# EAGLE schematic Central_MABOS (EAGLE 9.7.0)
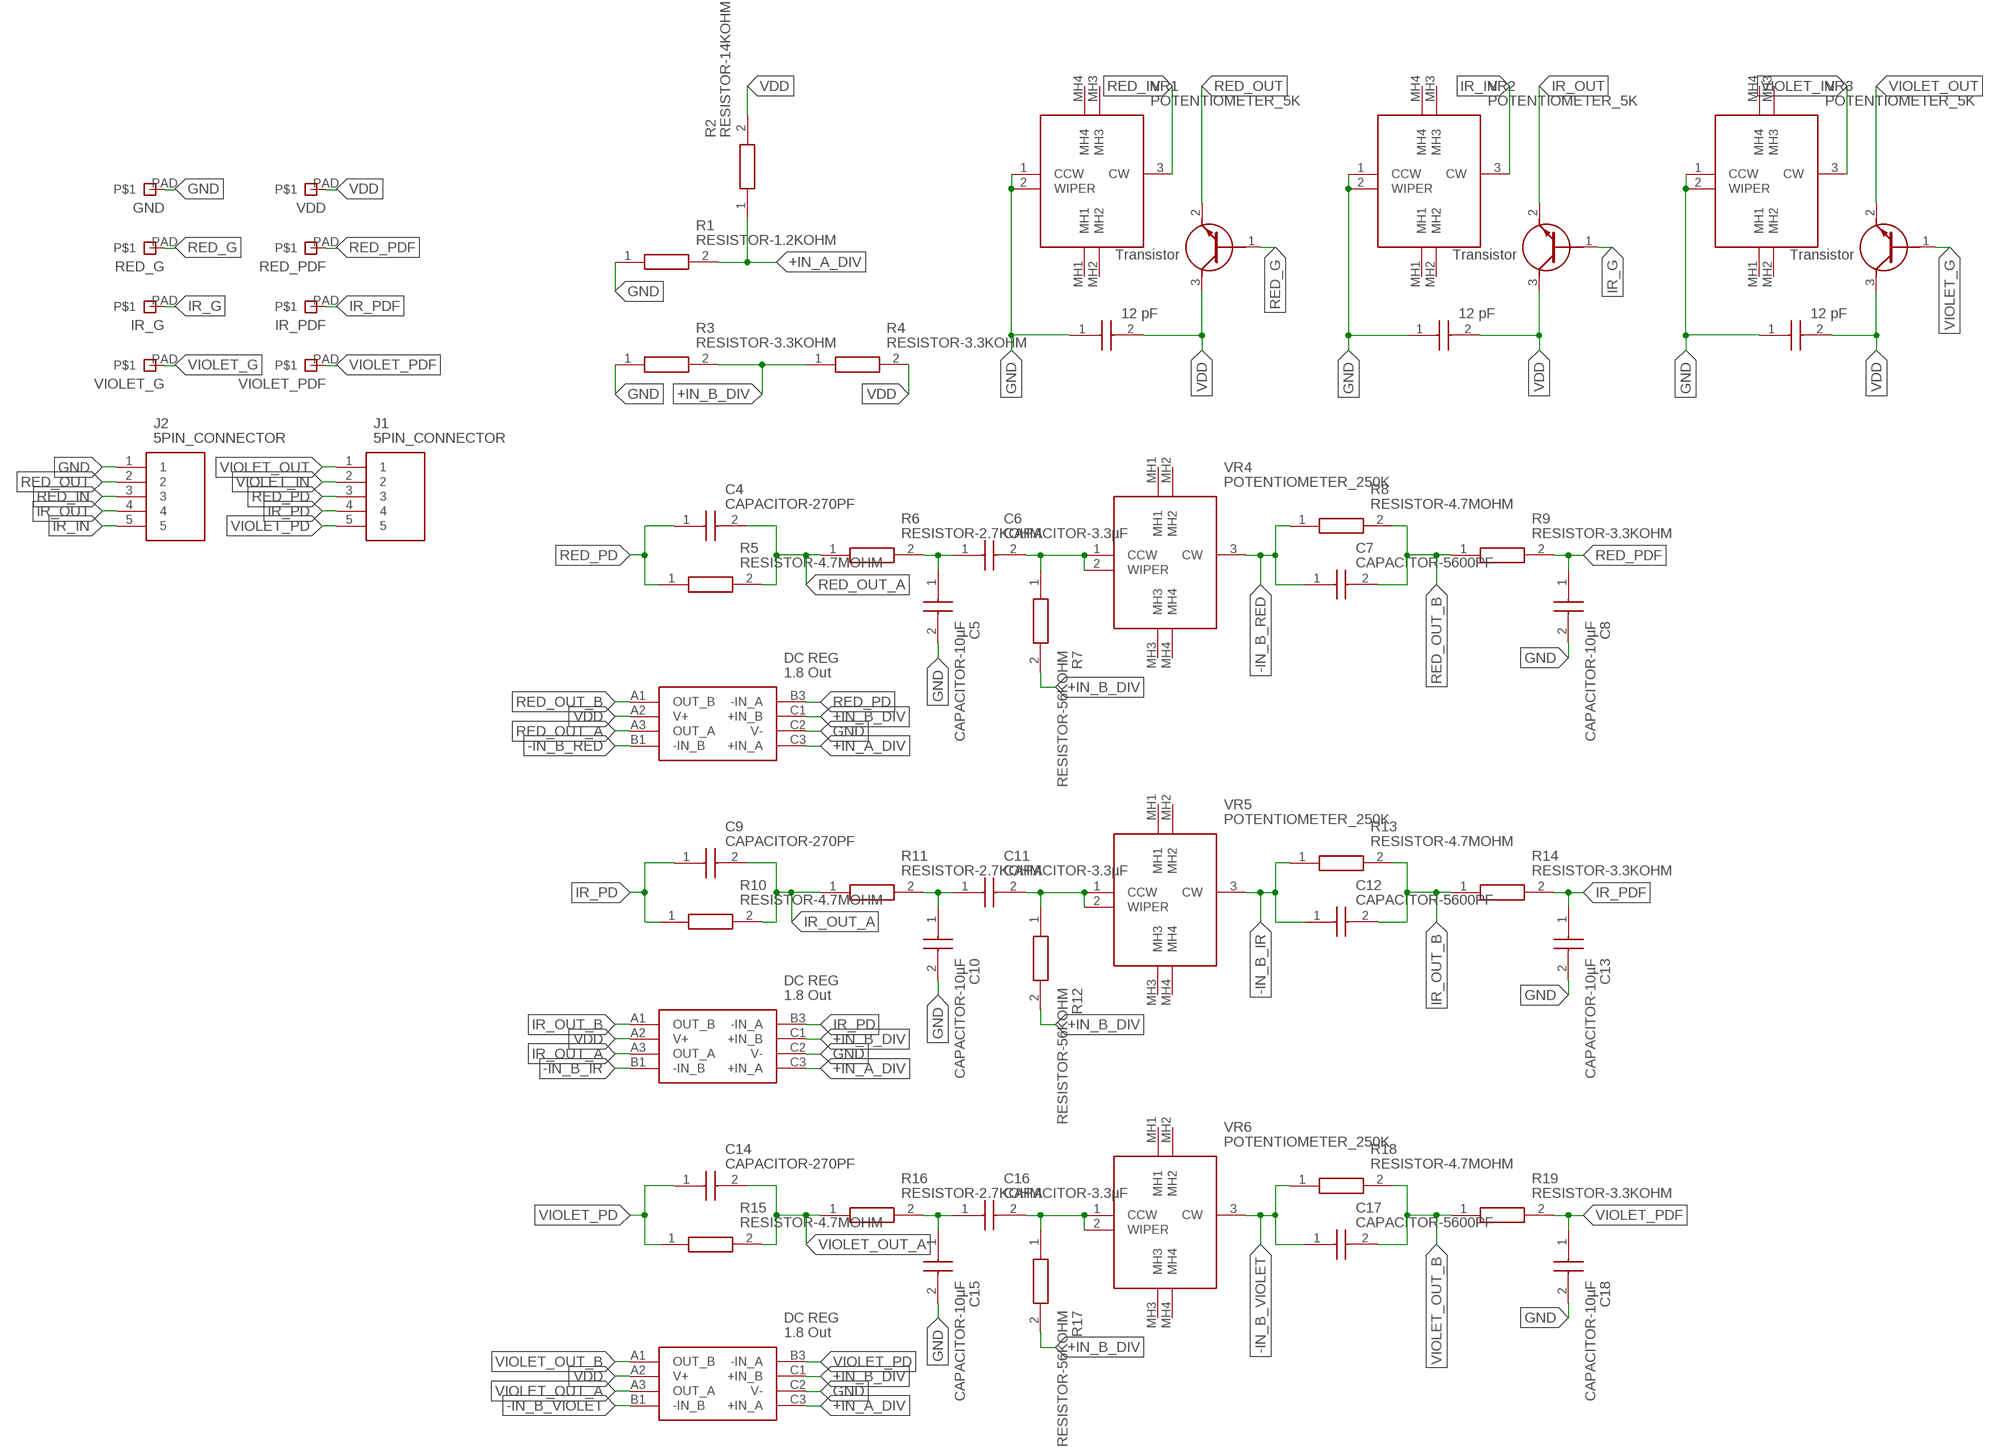
[diagram p0: schematic, sheet 1]

## Parts
C1  CAPACITOR-12PF  [CAPC1005X55N]
C2  CAPACITOR-12PF  [CAPC1005X55N]
C3  CAPACITOR-12PF  [CAPC1005X55N]
C4  CAPACITOR-270PF  [CAPC1005X55N]
C5  CAPACITOR-10µF  [C0402]
C6  CAPACITOR-3.3µF  [C0402]
C7  CAPACITOR-5600PF  [CAPC1005X55N]
C8  CAPACITOR-10µF  [C0402]
C9  CAPACITOR-270PF  [CAPC1005X55N]
C10  CAPACITOR-10µF  [C0402]
C11  CAPACITOR-3.3µF  [C0402]
C12  CAPACITOR-5600PF  [CAPC1005X55N]
C13  CAPACITOR-10µF  [C0402]
C14  CAPACITOR-270PF  [CAPC1005X55N]
C15  CAPACITOR-10µF  [C0402]
C16  CAPACITOR-3.3µF  [C0402]
C17  CAPACITOR-5600PF  [CAPC1005X55N]
C18  CAPACITOR-10µF  [C0402]
GND  PAD  [PAD]
IC1  ADA4505-2  [BGA8C50P3X3_142X142X65]
IC2  ADA4505-2  [BGA8C50P3X3_142X142X65]
IC3  ADA4505-2  [BGA8C50P3X3_142X142X65]
IR_G  PAD  [PAD]
IR_PDF  PAD  [PAD]
J1  5PIN_CONNECTOR  [SHDR5W114P0X419_1X5_2228X658X1]
J2  5PIN_CONNECTOR  [SHDR5W114P0X419_1X5_2228X658X1]
Q1  TRANSISTOR  [SOT883B]
Q2  TRANSISTOR  [SOT883B]
Q3  TRANSISTOR  [SOT883B]
R1  RESISTOR-1.2KOHM  [ERJPA2_(0402)]
R2  RESISTOR-14KOHM  [ERJ2RKD1004X]
R3  RESISTOR-3.3KOHM  [ERJPA2_(0402)]
R4  RESISTOR-3.3KOHM  [ERJPA2_(0402)]
R5  RESISTOR-4.7MOHM  [ERJ2RKD1004X]
R6  RESISTOR-2.7KOHM  [ERJPA2_(0402)]
R7  RESISTOR-56KOHM  [ERJ2RKD1004X]
R8  RESISTOR-4.7MOHM  [ERJ2RKD1004X]
R9  RESISTOR-3.3KOHM  [ERJPA2_(0402)]
R10  RESISTOR-4.7MOHM  [ERJ2RKD1004X]
R11  RESISTOR-2.7KOHM  [ERJPA2_(0402)]
R12  RESISTOR-56KOHM  [ERJ2RKD1004X]
R13  RESISTOR-4.7MOHM  [ERJ2RKD1004X]
R14  RESISTOR-3.3KOHM  [ERJPA2_(0402)]
R15  RESISTOR-4.7MOHM  [ERJ2RKD1004X]
R16  RESISTOR-2.7KOHM  [ERJPA2_(0402)]
R17  RESISTOR-56KOHM  [ERJ2RKD1004X]
R18  RESISTOR-4.7MOHM  [ERJ2RKD1004X]
R19  RESISTOR-3.3KOHM  [ERJPA2_(0402)]
RED_G  PAD  [PAD]
RED_PDF  PAD  [PAD]
VDD  PAD  [PAD]
VIOLET_G  PAD  [PAD]
VIOLET_PDF  PAD  [PAD]
VR1  POTENTIOMETER_5K  [POTENTIOMETER]
VR2  POTENTIOMETER_5K  [POTENTIOMETER]
VR3  POTENTIOMETER_5K  [POTENTIOMETER]
VR4  POTENTIOMETER_250K  [PTA60432015DPB254]
VR5  POTENTIOMETER_250K  [PTA60432015DPB254]
VR6  POTENTIOMETER_250K  [PTA60432015DPB254]

## Nets
+IN_A_DIV: IC1.C3(+IN_A) IC2.C3(+IN_A) IC3.C3(+IN_A) R1.2 R2.1
+IN_B_DIV: IC1.C1(+IN_B) IC2.C1(+IN_B) IC3.C1(+IN_B) R3.2 R4.1 R7.2 R12.2 R17.2
-IN_B_IR: C12.1 IC2.B1(-IN_B) R13.1 VR5.3(CW)
-IN_B_RED: C7.1 IC1.B1(-IN_B) R8.1 VR4.3(CW)
-IN_B_VIOLET: C17.1 IC3.B1(-IN_B) R18.1 VR6.3(CW)
GND: C1.1 C2.1 C3.1 C5.2 C8.2 C10.2 C13.2 C15.2 C18.2 GND.PAD IC1.C2(V-) IC2.C2(V-) IC3.C2(V-) J2.1 R1.1 R3.1 VR1.1(CCW) VR1.2(WIPER) VR2.1(CCW) VR2.2(WIPER) VR3.1(CCW) VR3.2(WIPER)
IR_G: IR_G.PAD Q2.1(B)
IR_IN: J2.5 VR2.3(CW)
IR_OUT: J2.4 Q2.2(E)
IR_OUT_A: C9.2 IC2.A3(OUT_A) R10.2 R11.1
IR_OUT_B: C12.2 IC2.A1(OUT_B) R13.2 R14.1
IR_PD: C9.1 IC2.B3(-IN_A) J1.4 R10.1
IR_PDF: C13.1 IR_PDF.PAD R14.2
N$3: C5.1 C6.1 R6.2
N$4: C6.2 R7.1 VR4.1(CCW) VR4.2(WIPER)
N$13: C10.1 C11.1 R11.2
N$14: C11.2 R12.1 VR5.1(CCW) VR5.2(WIPER)
N$23: C15.1 C16.1 R16.2
N$24: C16.2 R17.1 VR6.1(CCW) VR6.2(WIPER)
RED_G: Q1.1(B) RED_G.PAD
RED_IN: J2.3 VR1.3(CW)
RED_OUT: J2.2 Q1.2(E)
RED_OUT_A: C4.2 IC1.A3(OUT_A) R5.2 R6.1
RED_OUT_B: C7.2 IC1.A1(OUT_B) R8.2 R9.1
RED_PD: C4.1 IC1.B3(-IN_A) J1.3 R5.1
RED_PDF: C8.1 R9.2 RED_PDF.PAD
VDD: C1.2 C2.2 C3.2 IC1.A2(V+) IC2.A2(V+) IC3.A2(V+) Q1.3(C) Q2.3(C) Q3.3(C) R2.2 R4.2 VDD.PAD
VIOLET_G: Q3.1(B) VIOLET_G.PAD
VIOLET_IN: J1.2 VR3.3(CW)
VIOLET_OUT: J1.1 Q3.2(E)
VIOLET_OUT_A: C14.2 IC3.A3(OUT_A) R15.2 R16.1
VIOLET_OUT_B: C17.2 IC3.A1(OUT_B) R18.2 R19.1
VIOLET_PD: C14.1 IC3.B3(-IN_A) J1.5 R15.1
VIOLET_PDF: C18.1 R19.2 VIOLET_PDF.PAD
Unconnected: VR1.MH1 VR1.MH2 VR1.MH3 VR1.MH4 VR2.MH1 VR2.MH2 VR2.MH3 VR2.MH4 VR3.MH1 VR3.MH2 VR3.MH3 VR3.MH4 VR4.MH1 VR4.MH2 VR4.MH3 VR4.MH4 VR5.MH1 VR5.MH2 VR5.MH3 VR5.MH4 VR6.MH1 VR6.MH2 VR6.MH3 VR6.MH4

## Library data of the parts
C1-C3 = MABOS_components:CAPACITOR-12PF: 12 pF; DESCRIPTION: Multilayer Ceramic Capacitors MLCC - SMD/SMT 12pF 2% 25V C0G; HEIGHT: 0.55mm; MANUFACTURER_NAME: Kemet; MANUFACTURER_PART_NUMBER: C0402C120G3GACTU; MOUSER_PART_NUMBER: 80-C0402C120G3G; MOUSER_PRICE-STOCK: https://www.mouser.com/Search/Refine.aspx?Keyword=80-C0402C120G3G
C4 C9 C14 = MABOS_components:CAPACITOR-270PF: SMD Comm C0G, Ceramic, 270 pF, 2%, 50 VDC, 125 VDC, 125C, -55C, C0G, SMD, MLCC, Ultra-Stable, Low Loss, Class I, 0.1 % , 100 GOhms, 1.06 mg, 0402, 1mm, 0.5mm, 0.5mm, 0.3mm, 0.3mm, 10000, 78 Weeks, 120 Source: Datasheet <https://componentsearchengine.com/Datasheets/1/C0402C271G5GACTU.pdf>; DESCRIPTION: SMD Comm C0G, Ceramic, 270 pF, 2%, 50 VDC, 125 VDC, 125C, -55C, C0G, SMD, MLCC, Ultra-Stable, Low Loss, Class I, 0.1 % , 100 GOhms, 1.06 mg, 0402, 1mm, 0.5mm, 0.5mm, 0.3mm, 0.3mm, 10000, 78 Weeks, 120; HEIGHT: 0.55mm; MANUFACTURER_NAME: KEMET; MANUFACTURER_PART_NUMBER: C0402C271G5GACTU; MOUSER_PART_NUMBER: 80-C0402C271G5G; MOUSER_PRICE-STOCK: https://www.mouser.com/Search/Refine.aspx?Keyword=80-C0402C271G5G
C5 C8 C10 C13 C15 C18 = MABOS_components:CAPACITOR-10µF: SMD Comm X5R, Ceramic, 10 uF, 20%, 6.3 VDC, 15.75 VDC, 85C, -55C, X5R, SMD, MLCC, Temperature Stable, Class II, 10 % , 10 MOhms, 1.41 mg, 0402, 1mm, 0.5mm, 0.5mm, 0.3mm, 0.3mm, 10000, 78 Weeks, 70 Source: Datasheet <https://content.kemet.com/datasheets/KEM_C1006_X5R_SMD.pdf>; DESCRIPTION: SMD Comm X5R, Ceramic, 10 uF, 20%, 6.3 VDC, 15.75 VDC, 85C, -55C, X5R, SMD, MLCC, Temperature Stable, Class II, 10 % , 10 MOhms, 1.41 mg, 0402, 1mm, 0.5mm, 0.5mm, 0.3mm, 0.3mm, 10000, 78 Weeks, 70; HEIGHT: 0.55mm; MANUFACTURER_NAME: KEMET; MANUFACTURER_PART_NUMBER: C0402C106M9PACTU; MOUSER_PART_NUMBER: 80-C0402C106M9P; MOUSER_PRICE-STOCK: https://www.mouser.co.uk/ProductDetail/KEMET/C0402C106M9PACTU?qs=x4XeXhDQKnp%252Bz0lMlwMC3A%3D%3D
C6 C11 C16 = MABOS_components:CAPACITOR-3.3µF: SMD Comm X5R, Ceramic, 3.3 uF, 20%, 4 VDC, 10 VDC, 85C, -55C, X5R, SMD, MLCC, Temperature Stable, Class II, 10 % , 30.3 MOhms, 1.21 mg, 0402, 1mm, 0.5mm, 0.5mm, 0.3mm, 0.3mm, 10000, 78 Weeks, 70 Source: Datasheet <https://content.kemet.com/datasheets/KEM_C1006_X5R_SMD.pdf>; DESCRIPTION: SMD Comm X5R, Ceramic, 3.3 uF, 20%, 4 VDC, 10 VDC, 85C, -55C, X5R, SMD, MLCC, Temperature Stable, Class II, 10 % , 30.3 MOhms, 1.21 mg, 0402, 1mm, 0.5mm, 0.5mm, 0.3mm, 0.3mm, 10000, 78 Weeks, 70; HEIGHT: 0.55mm; MANUFACTURER_NAME: KEMET; MANUFACTURER_PART_NUMBER: C0402C335M7PACTU; MOUSER_PART_NUMBER: 80-C0402C335M7P; MOUSER_PRICE-STOCK: https://www.mouser.co.uk/ProductDetail/KEMET/C0402C335M7PACTU?qs=K%2Fj%2Fqf%252B0fqJuKSSbbJXSEQ%3D%3D
C7 C12 C17 = MABOS_components:CAPACITOR-5600PF: SMD Comm X7R, Ceramic, 5600 pF, 5%, 16 VDC, 40 VDC, 125C, -55C, X7R, SMD, MLCC, Temperature Stable, Class II, 3.5 % , 100 GOhms, 1.21 mg, 0402, 1mm, 0.5mm, 0.5mm, 0.3mm, 0.3mm, 10000, 78 Weeks, 80 Source: Datasheet <https://content.kemet.com/datasheets/KEM_C1002_X7R_SMD.pdf>; DESCRIPTION: SMD Comm X7R, Ceramic, 5600 pF, 5%, 16 VDC, 40 VDC, 125C, -55C, X7R, SMD, MLCC, Temperature Stable, Class II, 3.5 % , 100 GOhms, 1.21 mg, 0402, 1mm, 0.5mm, 0.5mm, 0.3mm, 0.3mm, 10000, 78 Weeks, 80; HEIGHT: 0.55mm; MANUFACTURER_NAME: KEMET; MANUFACTURER_PART_NUMBER: C0402C562J4RACTU; MOUSER_PART_NUMBER: 80-C0402C562J4R; MOUSER_PRICE-STOCK: https://www.mouser.co.uk/ProductDetail/KEMET/C0402C562J4RACTU?qs=YJD0VjdmSUns5e35Blws8w%3D%3D
GND IR_G IR_PDF RED_G RED_PDF VDD VIOLET_G VIOLET_PDF = Nordic_BLE:PAD
IC1-IC3 = MABOS_components:ADA4505-2: Op Amp (2); DESCRIPTION: ANALOG DEVICES - ADA4505-2ACBZ-R7 - OP-AMP, DUAL, 50KHZ, WLCSP-8; HEIGHT: 0.65mm; MANUFACTURER_NAME: Analog Devices; MANUFACTURER_PART_NUMBER: ADA4505-2ACBZ-R7; MOUSER_PART_NUMBER: 584-ADA4505-2ACBZ-R7; MOUSER_PRICE-STOCK: https://www.mouser.co.uk/ProductDetail/Analog-Devices/ADA4505-2ACBZ-R7?qs=BpaRKvA4VqEsLtXU3NSLDQ%3D%3D
J1 J2 = MABOS_components:5PIN_CONNECTOR: Samtec IPBT, 4.19mm Pitch, 5 Way, 1 Row PCB Terminal Block Header, Through Hole Source: Datasheet <http://suddendocs.samtec.com/catalog_english/ipbt.pdf>; DESCRIPTION: Samtec IPBT, 4.19mm Pitch, 5 Way, 1 Row PCB Terminal Block Header, Through Hole; HEIGHT: 10.29mm; MANUFACTURER_NAME: SAMTEC; MANUFACTURER_PART_NUMBER: IPBT-105-H1-T-S-K; MOUSER_PART_NUMBER: 200-IPBT105H1TSK; MOUSER_PRICE-STOCK: https://www.mouser.co.uk/ProductDetail/Samtec/IPBT-105-H1-T-S-K?qs=PB6%2FjmICvI0oo3MGzaPD2A%3D%3D
Q1-Q3 = MABOS_components:TRANSISTOR: Bipolar Transistors - BJT 45V NPN 100mA 250mW Source: Datasheet <https://componentsearchengine.com/Datasheets/1/BC847BMB,315.pdf>; DESCRIPTION: Bipolar Transistors - BJT 45V NPN 100mA 250mW; HEIGHT: mm; MANUFACTURER_NAME: Nexperia; MANUFACTURER_PART_NUMBER: BC847BMB,315; MOUSER_PART_NUMBER: 771-BC847BMB315; MOUSER_PRICE-STOCK: https://www.mouser.co.uk/ProductDetail/Nexperia/BC847BMB315?qs=5C9Q4QJFsuN7bUmIcU4LYw%3D%3D
R1 = MABOS_components:RESISTOR-1.2KOHM: Anti-Surge Thick Film Chip Resistor, 0402, 0.2W Source: Datasheet <https://componentsearchengine.com/Datasheets/1/ERJ-PA2D1201X.pdf>; DESCRIPTION: Anti-Surge Thick Film Chip Resistor, 0402, 0.2W; HEIGHT: 0.4mm; MANUFACTURER_NAME: Panasonic; MANUFACTURER_PART_NUMBER: ERJ-PA2D1201X; MOUSER_PART_NUMBER: 667-ERJ-PA2D1201X; MOUSER_PRICE-STOCK: https://www.mouser.com/Search/Refine.aspx?Keyword=667-ERJ-PA2D1201X
R2 = MABOS_components:RESISTOR-14KOHM: Panasonic ERJ2RK Series Thick Film Resistor 14k +/-1% 0.1W +/-100ppm/C Source: Datasheet <https://componentsearchengine.com/Datasheets/1/ERJ-2RKF1402X.pdf>; DESCRIPTION: Panasonic ERJ2RK Series Thick Film Resistor 14k +/-1% 0.1W +/-100ppm/C; HEIGHT: 0.4mm; MANUFACTURER_NAME: Panasonic; MANUFACTURER_PART_NUMBER: ERJ-2RKF1402X; MOUSER_PART_NUMBER: 667-ERJ-2RKF1402X; MOUSER_PRICE-STOCK: https://www.mouser.com/Search/ProductDetail.aspx?qs=MVjVSMjNRMrMgFTFLdW36A%3d%3d
R3 R4 R9 R14 R19 = MABOS_components:RESISTOR-3.3KOHM: Anti-Surge Thick Film Chip Resistor, 0402, 0.2W Source: Datasheet <https://componentsearchengine.com/Datasheets/1/ERJ-PA2F3301X.pdf>; DESCRIPTION: Anti-Surge Thick Film Chip Resistor, 0402, 0.2W; HEIGHT: 0.4mm; MANUFACTURER_NAME: Panasonic; MANUFACTURER_PART_NUMBER: ERJ-PA2F3301X; MOUSER_PART_NUMBER: 667-ERJ-PA2F3301X; MOUSER_PRICE-STOCK: https://www.mouser.com/Search/Refine.aspx?Keyword=667-ERJ-PA2F3301X
R5 R8 R10 R13 R15 R18 = MABOS_components:RESISTOR-4.7MOHM: Panasonic ERJ2GEJ Series Thick Film Surface Mount Fixed Resistor 0402 Case 4.7M +/-5% 0.1W -400 +150ppm/C Source: Datasheet <https://componentsearchengine.com/Datasheets/1/ERJ-2GEJ475X.pdf>; DESCRIPTION: Panasonic ERJ2GEJ Series Thick Film Surface Mount Fixed Resistor 0402 Case 4.7M +/-5% 0.1W -400 +150ppm/C; HEIGHT: 0.4mm; MANUFACTURER_NAME: Panasonic; MANUFACTURER_PART_NUMBER: ERJ-2GEJ475X; MOUSER_PART_NUMBER: 667-ERJ-2GEJ475X; MOUSER_PRICE-STOCK: https://www.mouser.com/Search/Refine.aspx?Keyword=667-ERJ-2GEJ475X
R6 R11 R16 = MABOS_components:RESISTOR-2.7KOHM: Anti-Surge Thick Film Chip Resistor, 0402, 0.2W Source: Datasheet <http://industrial.panasonic.com/cdbs/www-data/pdf/RDO0000/AOA0000C331.pdf>; DESCRIPTION: Anti-Surge Thick Film Chip Resistor, 0402, 0.2W; HEIGHT: 0.4mm; MANUFACTURER_NAME: Panasonic; MANUFACTURER_PART_NUMBER: ERJ-PA2F2701X
R7 R12 R17 = MABOS_components:RESISTOR-56KOHM: Precision Thick Film Chip Resistor, 0402, 0.063W Source: Datasheet <https://componentsearchengine.com/Datasheets/1/ERJ-2RKF5602X.pdf>; DESCRIPTION: Precision Thick Film Chip Resistor, 0402, 0.063W; HEIGHT: 0.4mm; MANUFACTURER_NAME: Panasonic; MANUFACTURER_PART_NUMBER: ERJ-2RKF5602X; MOUSER_PART_NUMBER: 667-ERJ-2RKF5602X; MOUSER_PRICE-STOCK: https://www.mouser.com/Search/Refine.aspx?Keyword=667-ERJ-2RKF5602X
VR1-VR3 = MABOS_components:POTENTIOMETER_5K: SLIDE POT 5K OHM TOP 15MM - Through Hole Slide Potentiometer Top Adjustment Type SLIDE POT 5K OHM TOP 15MM Source: Datasheet; DESCRIPTION: SLIDE POT 5K OHM TOP 15MM - Through Hole Slide Potentiometer Top Adjustment Type SLIDE POT 5K OHM TOP 15MM; HEIGHT: 17mm; MANUFACTURER_NAME: TT Electronics; MANUFACTURER_PART_NUMBER: PS15-10PC1BR5K; MOUSER_PART_NUMBER: 858-PS1510PC1BR5K; MOUSER_PRICE-STOCK: https://www.mouser.co.uk/ProductDetail/BI-Technologies-TT-Electronics/PS15-10PC1BR5K/?qs=1MXlzafEN399P50A%252By84yQ%3D%3D
VR4-VR6 = MABOS_components:POTENTIOMETER_250K: Slide Potentiometers 250K LINEAR Source: Datasheet <https://www.bourns.com/docs/Product-Datasheets/pta.pdf>; DESCRIPTION: Slide Potentiometers 250K LINEAR; HEIGHT: 21.5mm; MANUFACTURER_NAME: Bourns; MANUFACTURER_PART_NUMBER: PTA6043-2015DPB254; MOUSER_PART_NUMBER: 652-PTA6432015DPB254; MOUSER_PRICE-STOCK: https://www.mouser.co.uk/ProductDetail/Bourns/PTA6043-2015DPB254?qs=JCQZbRdZgKbjH0wkhhYAqQ%3D%3D